# EasyEDA Pro project ProPrj_Hitboard PCB v2.epro

# Board PCB1
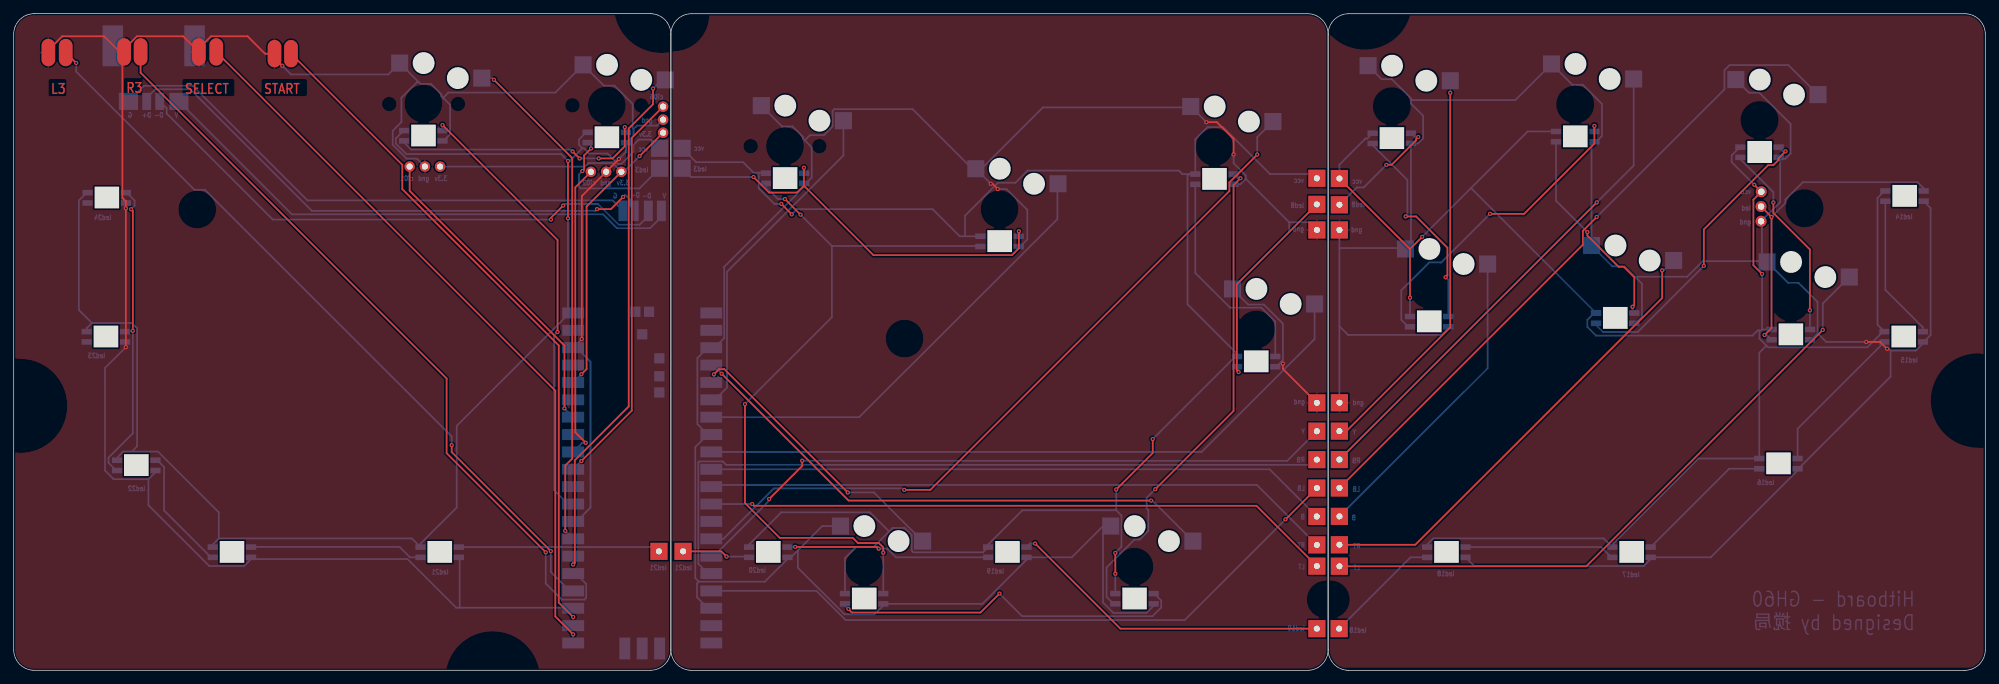
[diagram p0: board, top side]
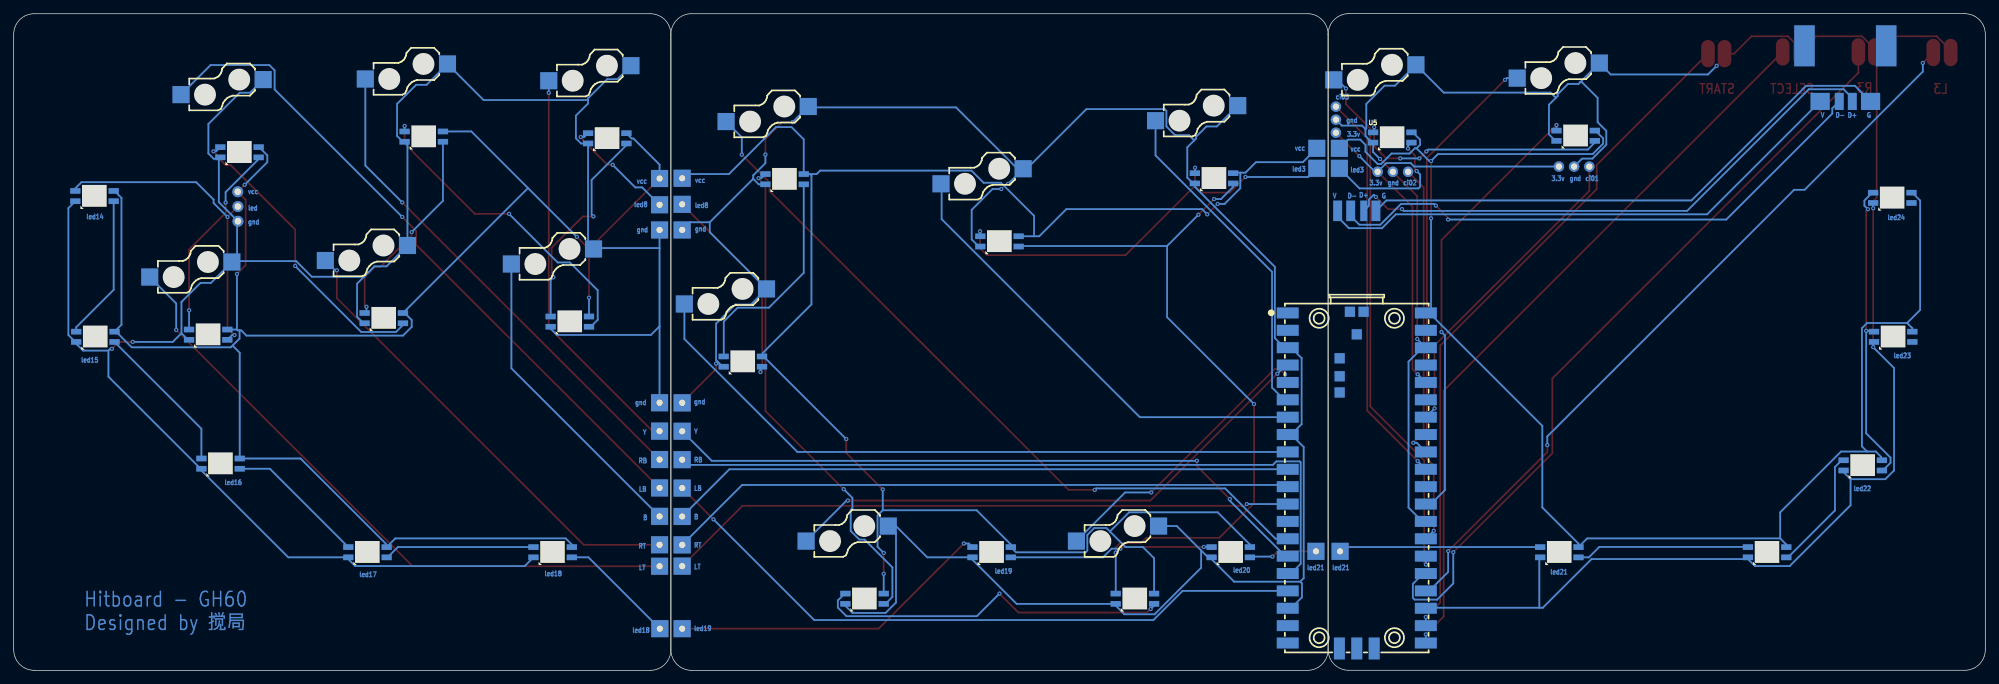
[diagram p1: board, bottom side, seen from below]

Outline 288.03 x 96.01 mm; copper layers: Top Layer, Bottom Layer. Coordinates in mm from the lower left corner of the outline.
Outline path: 0,93.01 0,3.01 arc(0.88,0.88) 3,0.01 93,0.01 arc(95.12,0.88) 96,3.01 96,93.01 arc(95.12,95.13) 93,96.01 3,96.01 arc(0.88,95.13) 0,93.01 ; 96.02,93 96.02,3 arc(96.9,0.88) 99.02,0 189.02,0 arc(191.14,0.88) 192.02,3 192.02,93 arc(191.14,95.12) 189.02,96 99.02,96 arc(96.9,95.12) 96.02,93 ; 192.03,93 arc(192.91,95.12) 195.03,96 285.03,96 arc(287.15,95.12) 288.03,93 288.03,3 arc(287.15,0.88) 285.03,0 195.03,0 arc(192.91,0.88) 192.03,3 192.03,93
Stack: Top Layer 0.035mm / Dielectric1 1.51mm FR4 er 4.5 / Bottom Layer 0.035mm

## Design rules (mm)
template: JLCPCB Capability(Two Layers Board)
spacing copperThickness1oz (default): track to track 0.102, other pairs 0.152 to 0.3
spacing copperThickness2oz: track to track 0.203, other pairs 0.152 to 0.3
track width copperThickness1oz (default): min 0.127, default 0.254, max 2.54
track width copperThickness2oz: min 0.203, default 0.254, max 2.54
differential pair differentialPair (default): width min 0.127, default 0.254, max 2.54; gap min 0.152, default 0.152
via viaSize (default): diameter min 0.5, default 0.61, max 10; hole min 0.3, default 0.305, max 6.3

## Placement (name value [footprint] x y rotation side)
NOREF  -  [Pad_e13637]  193.68 71.91 0 top
NOREF#2  -  [Pad_e53994]  26.42 91.31 180 top
NOREF#3  -  [Pad_e61147]  255.27 67.81 0 top
NOREF#4  -  [Pad_e61146]  255.3 69.97 0 top
NOREF#5  -  [Pad_e296]  60.07 73.65 0 top
NOREF#6  -  [Pad_e13608]  190.37 15.23 0 top
NOREF#7  -  [Pad_e48]  84.33 72.89 0 top
NOREF#8  -  [Pad_e46]  88.77 72.89 0 top
NOREF#9  -  [Pad_e686]  24.13 83.18 180 top
NOREF#10  -  [Pad_e4879]  94.26 17.39 0 top
NOREF#11  -  [Pad_e676]  7.6 90.33 0 top
NOREF#12  -  [Pad_e682]  40.51 90.16 0 top
NOREF#13  -  [Pad_e68]  193.68 39.13 0 top
NOREF#14  -  [Pad_e114539]  190.37 39.11 0 top
NOREF#15  -  [Pad_e4877]  190.37 6.09 0 top
NOREF#16  -  [Pad_e683]  16.76 83.18 180 top
NOREF#17  -  [Pad_e61148]  255.27 65.65 0 top
NOREF#18  -  [Pad_e4875]  193.64 6.09 0 top
NOREF#19  -  [Pad_e300]  94.87 80.51 0 top
NOREF#20  -  [Pad_e693]  92.71 67.18 180 top
NOREF#21  -  [Pad_e13606]  190.37 22.49 0 top
NOREF#22  -  [Pad_e13607]  190.37 18.34 0 top
NOREF#23  -  [Pad_e72]  193.68 22.51 0 top
NOREF#24  -  [Pad_e74]  193.68 15.22 0 top
NOREF#25  -  [Pad_e679]  27.05 90.42 0 top
NOREF#26  -  [Pad_e13601]  190.37 68.13 0 top
NOREF#27  -  [Pad_e687]  97.66 76.32 0 top
NOREF#28  -  [Pad_e295]  62.29 73.65 0 top
NOREF#29  -  [Pad_e53995]  14.48 91.31 180 top
NOREF#30  -  [Pad_e678]  18.54 90.42 0 top
NOREF#31  -  [Pad_e681]  38.1 90.16 0 top
NOREF#32  -  [Pad_e685]  21.34 83.18 180 top
NOREF#33  -  [Pad_e299]  94.87 78.61 0 top
NOREF#34  -  [Pad_e677]  16.13 90.42 0 top
NOREF#35  -  [Pad_e73]  193.68 18.36 0 top
NOREF#36  -  [Pad_e13602]  190.37 64.38 0 top
NOREF#37  -  [Pad_e13600]  190.37 71.94 0 top
NOREF#38  -  [Pad_e680]  29.59 90.42 0 top
NOREF#39  -  [Pad_e294]  86.55 72.89 0 top
NOREF#40  -  [Pad_e13603]  190.37 34.96 0 top
NOREF#41  -  [Pad_e4881]  97.79 17.39 0 top
NOREF#42  -  [Pad_e691]  90.81 67.18 180 top
NOREF#43  -  [Pad_e6736]  94.36 76.32 0 top
NOREF#44  -  [Pad_e675]  5.06 90.33 0 top
NOREF#45  -  [Pad_e71]  193.68 26.66 0 top
NOREF#46  -  [Pad_e684]  19.43 83.18 180 top
NOREF#47  -  [Pad_e6738]  94.36 73.4 0 top
NOREF#48  -  [Pad_e70]  193.68 30.82 0 top
NOREF#49  -  [Pad_e6737]  97.66 73.4 0 top
NOREF#50  -  [Pad_e13636]  193.68 64.38 0 top
NOREF#51  -  [Pad_e13635]  193.68 68.07 0 top
NOREF#52  -  [Pad_e69]  193.68 34.97 0 top
NOREF#53  -  [Pad_e13604]  190.37 30.8 0 top
NOREF#54  -  [Pad_e301]  94.87 82.42 0 top
NOREF#55  -  [Pad_e689]  89.03 67.18 180 top
NOREF#56  -  [Pad_e694]  94.61 67.18 180 top
NOREF#57  -  [Pad_e13605]  190.37 26.65 0 top
NOREF#58  -  [Pad_e297]  57.85 73.65 0 top
U1  PICO  [COMM-SMD_L51.0-W21.0-P2.54_SC0916]  91.82 27.81 270 bottom
U5  -  [LED-SMD_L3.2-W2.8_YO-WS2812B-3528]  59.84 78.16 180 bottom
U5#2  -  [LED-SMD_L3.2-W2.8_YO-WS2812B-3528]  144.02 62.71 180 bottom
U5#3  -  [LED-SMD_L3.2-W2.8_YO-WS2812B-3528]  276.23 69.34 180 bottom
U5#4  -  [LED-SMD_L3.2-W2.8_YO-WS2812B-3528]  276.1 48.76 180 bottom
U5#5  -  [LED-SMD_L3.2-W2.8_YO-WS2812B-3528]  257.81 30.22 180 bottom
U5#6  -  [LED-SMD_L3.2-W2.8_YO-WS2812B-3528]  209.3 17.27 180 bottom
U5#7  -  [LED-SMD_L3.2-W2.8_YO-WS2812B-3528]  145.16 17.27 180 bottom
U5#8  -  [LED-SMD_L3.2-W2.8_YO-WS2812B-3528]  110.24 17.27 180 bottom
U5#9  -  [LED-SMD_L3.2-W2.8_YO-WS2812B-3528]  62.23 17.27 180 bottom
U5#10  -  [LED-SMD_L3.2-W2.8_YO-WS2812B-3528]  31.88 17.27 180 bottom
U5#11  -  [LED-SMD_L3.2-W2.8_YO-WS2812B-3528]  13.46 48.76 180 bottom
U5#12  -  [LED-SMD_L3.2-W2.8_YO-WS2812B-3528]  13.59 69.08 180 bottom
U5#13  -  [LED-SMD_L3.2-W2.8_YO-WS2812B-3528]  17.91 29.97 180 bottom
U5#14  -  [LED-SMD_L3.2-W2.8_YO-WS2812B-3528]  236.35 17.27 180 bottom
U5#15  -  [LED-SMD_L3.2-W2.8_YO-WS2812B-3528]  86.64 77.91 180 bottom
U5#16  -  [LED-SMD_L3.2-W2.8_YO-WS2812B-3528]  112.68 71.94 180 bottom
U5#17  -  [LED-SMD_L3.2-W2.8_YO-WS2812B-3528]  124.23 10.47 180 bottom
U5#18  -  [LED-SMD_L3.2-W2.8_YO-WS2812B-3528]  163.73 10.47 180 bottom
U5#19  -  [LED-SMD_L3.2-W2.8_YO-WS2812B-3528]  175.41 71.81 180 bottom
U5#20  -  [LED-SMD_L3.2-W2.8_YO-WS2812B-3528]  181.51 45.14 180 bottom
U5#21  -  [LED-SMD_L3.2-W2.8_YO-WS2812B-3528]  201.32 77.78 180 bottom
U5#22  -  [LED-SMD_L3.2-W2.8_YO-WS2812B-3528]  206.78 50.98 180 bottom
U5#23  -  [LED-SMD_L3.2-W2.8_YO-WS2812B-3528]  228.12 78.03 180 bottom
U5#24  -  [LED-SMD_L3.2-W2.8_YO-WS2812B-3528]  233.96 51.49 180 bottom
U5#25  -  [LED-SMD_L3.2-W2.8_YO-WS2812B-3528]  255.04 75.75 180 bottom
U5#26  -  [LED-SMD_L3.2-W2.8_YO-WS2812B-3528]  259.62 49.08 180 bottom
U6  -  [CONN-SMD_HOTPLUGPAKAGE__C9900010116-1]  146.56 72.24 180 bottom
U6#2  -  [CONN-SMD_HOTPLUGPAKAGE__C9900010116-1]  62.38 87.68 180 bottom
U6#3  -  [CONN-SMD_HOTPLUGPAKAGE__C9900010116-1]  89.18 87.43 180 bottom
U6#4  -  [CONN-SMD_HOTPLUGPAKAGE__C9900010116-1]  115.22 81.46 180 bottom
U6#5  -  [CONN-SMD_HOTPLUGPAKAGE__C9900010116-1]  126.77 19.99 180 bottom
U6#6  -  [CONN-SMD_HOTPLUGPAKAGE__C9900010116-1]  166.27 19.99 180 bottom
U6#7  -  [CONN-SMD_HOTPLUGPAKAGE__C9900010116-1]  177.95 81.33 180 bottom
U6#8  -  [CONN-SMD_HOTPLUGPAKAGE__C9900010116-1]  184.05 54.66 180 bottom
U6#9  -  [CONN-SMD_HOTPLUGPAKAGE__C9900010116-1]  203.86 87.3 180 bottom
U6#10  -  [CONN-SMD_HOTPLUGPAKAGE__C9900010116-1]  209.32 60.51 180 bottom
U6#11  -  [CONN-SMD_HOTPLUGPAKAGE__C9900010116-1]  230.66 87.56 180 bottom
U6#12  -  [CONN-SMD_HOTPLUGPAKAGE__C9900010116-1]  236.5 61.01 180 bottom
U6#13  -  [CONN-SMD_HOTPLUGPAKAGE__C9900010116-1]  257.58 85.27 180 bottom
U6#14  -  [CONN-SMD_HOTPLUGPAKAGE__C9900010116-1]  262.16 58.6 180 bottom

## Footprints (pads in the part's own frame, mm; a bottom-side part is the same pattern mirrored in y, then rotated)
COMM-SMD_L51.0-W21.0-P2.54_SC0916
  rect 1.6x3.2 smd: 1(-24.445,-10.088) 2(-21.905,-10.088) 3(-19.365,-10.088) 4(-16.825,-10.088) 5(-14.285,-10.088) 6(-11.745,-10.088) 7(-9.205,-10.088) 8(-6.665,-10.088) 9(-4.125,-10.088) 10(-1.585,-10.088) 11(0.955,-10.088) 12(3.495,-10.088) 13(6.035,-10.088) 14(8.575,-10.088) 15(11.115,-10.088) 16(13.655,-10.088) 17(16.195,-10.088) 18(18.735,-10.088) 19(21.275,-10.088) 20(23.815,-10.088) 21(23.815,10.088) 22(21.275,10.088) 23(18.735,10.088) 24(16.195,10.088) 25(13.655,10.088) 26(11.115,10.088) 27(8.575,10.088) 28(6.035,10.088) 29(3.495,10.088) 30(0.955,10.088) 31(-1.585,10.088) 32(-4.125,10.088) 33(-6.665,10.088) 34(-9.205,10.088) 35(-11.745,10.088) 36(-14.285,10.088) 37(-16.825,10.088) 38(-19.365,10.088) 39(-21.905,10.088) 40(-24.445,10.088)
  rect 3.2x1.6 smd: 41(24.615,-2.54) 42(24.615,0) 43(24.615,2.54)
  rect 1.5x1.5 smd: TP1(-21.315,0) TP2(-24.615,1) TP3(-24.615,-1) TP4(-17.815,-2.5) TP5(-15.188,-2.5) TP6(-12.815,-2.5)
CONN-SMD_HOTPLUGPAKAGE__C9900010116-1
  rect 2.5x2.5 smd: 1(-6,-1.1) 2(6,1.1)
LED-SMD_L3.2-W2.8_YO-WS2812B-3528
  rect 1.5x0.82 smd: 1(2.8,0.75) 2(2.8,-0.75) 3(-2.8,-0.75) 4(-2.8,0.75)
Pad_e46
  round 1.524 hole 0.914: 1(0,0)
Pad_e48
  round 1.524 hole 0.914: 1(0,0)
Pad_e68
  rect 2.5x2.5 hole 0.9: PTH(0,0)
Pad_e69
  rect 2.5x2.5 hole 0.9: PTH(0,0)
Pad_e70
  rect 2.5x2.5 hole 0.9: PTH(0,0)
Pad_e71
  rect 2.5x2.5 hole 0.9: PTH(0,0)
Pad_e72
  rect 2.5x2.5 hole 0.9: PTH(0,0)
Pad_e73
  rect 2.5x2.5 hole 0.9: PTH(0,0)
Pad_e74
  rect 2.5x2.5 hole 0.9: PTH(0,0)
Pad_e294
  round 1.524 hole 0.914: 1(0,0)
Pad_e295
  round 1.524 hole 0.914: 1(0,0)
Pad_e296
  round 1.524 hole 0.914: 1(0,0)
Pad_e297
  round 1.524 hole 0.914: 1(0,0)
Pad_e299
  round 1.524 hole 0.914: 1(0,0)
Pad_e300
  round 1.524 hole 0.914: 1(0,0)
Pad_e301
  round 1.524 hole 0.914: 1(0,0)
Pad_e675
  oval 2x4 smd: 1(0,0)
Pad_e676
  oval 2x4 smd: 1(0,0)
Pad_e677
  oval 2x4 smd: 1(0,0)
Pad_e678
  oval 2x4 smd: 1(0,0)
Pad_e679
  oval 2x4 smd: 1(0,0)
Pad_e680
  oval 2x4 smd: 1(0,0)
Pad_e681
  oval 2x4 smd: 1(0,0)
Pad_e682
  oval 2x4 smd: 1(0,0)
Pad_e683
  rect 2.8x2.5 smd far side: PTH(0,0)
Pad_e684
  rect 1.3x2.5 smd far side: PTH(0,0)
Pad_e685
  rect 1.3x2.5 smd far side: PTH(0,0)
Pad_e686
  rect 2.8x2.5 smd far side: PTH(0,0)
Pad_e687
  rect 2.5x2.5 smd far side: PTH(0,0)
Pad_e689
  rect 1.3x3 smd far side: PTH(0,0)
Pad_e691
  rect 1x3 smd far side: PTH(0,0)
Pad_e693
  rect 1.3x3 smd far side: PTH(0,0)
Pad_e694
  rect 1.3x3 smd far side: PTH(0,0)
Pad_e4875
  rect 2.5x2.5 hole 0.9: PTH(0,0)
Pad_e4877
  rect 2.5x2.5 hole 0.9: PTH(0,0)
Pad_e4879
  rect 2.5x2.5 hole 0.9: PTH(0,0)
Pad_e4881
  rect 2.5x2.5 hole 0.9: PTH(0,0)
Pad_e6736
  rect 2.5x2.5 smd far side: PTH(0,0)
Pad_e6737
  rect 2.5x2.5 smd far side: PTH(0,0)
Pad_e6738
  rect 2.5x2.5 smd far side: PTH(0,0)
Pad_e13600
  rect 2.5x2.5 hole 0.9: PTH(0,0)
Pad_e13601
  rect 2.5x2.5 hole 0.9: PTH(0,0)
Pad_e13602
  rect 2.5x2.5 hole 0.9: PTH(0,0)
Pad_e13603
  rect 2.5x2.5 hole 0.9: PTH(0,0)
Pad_e13604
  rect 2.5x2.5 hole 0.9: PTH(0,0)
Pad_e13605
  rect 2.5x2.5 hole 0.9: PTH(0,0)
Pad_e13606
  rect 2.5x2.5 hole 0.9: PTH(0,0)
Pad_e13607
  rect 2.5x2.5 hole 0.9: PTH(0,0)
Pad_e13608
  rect 2.5x2.5 hole 0.9: PTH(0,0)
Pad_e13635
  rect 2.5x2.5 hole 0.9: PTH(0,0)
Pad_e13636
  rect 2.5x2.5 hole 0.9: PTH(0,0)
Pad_e13637
  rect 2.5x2.5 hole 0.9: PTH(0,0)
Pad_e53994
  rect 3x6 smd far side: PTH(0,0)
Pad_e53995
  rect 3x6 smd far side: PTH(0,0)
Pad_e61146
  round 1.6 hole 0.96: PTH(0,0)
Pad_e61147
  round 1.6 hole 0.96: PTH(0,0)
Pad_e61148
  round 1.6 hole 0.96: PTH(0,0)
Pad_e114539
  rect 2.5x2.5 hole 0.9: PTH(0,0)

## Nets
3V3: NOREF#8.1 NOREF#28.1 NOREF#33.1 U1.36
GND: NOREF#5.1 NOREF#13.PTH NOREF#14.PTH NOREF#17.PTH NOREF#19.1 NOREF#25.1 NOREF#31.1 NOREF#34.1 NOREF#36.PTH NOREF#39.1 NOREF#44.1 NOREF#50.PTH U1.3 U1.8 U1.18 U1.23 U1.28 U1.38 U5.3 U5#2.3 U5#3.3 U5#4.3 U5#5.3 U5#6.3 U5#7.3 U5#8.3 U5#9.3 U5#10.3 U5#11.3 U5#12.3 U5#13.3 U5#14.3 U5#15.3 U5#16.3 U5#17.3 U5#18.3 U5#19.3 U5#20.3 U5#21.3 U5#22.3 U5#23.3 U5#24.3 U5#25.3 U5#26.3 U6.2 U6#2.2 U6#3.2 U6#4.2 U6#5.2 U6#6.2 U6#7.2 U6#8.2 U6#9.2 U6#10.2 U6#11.2 U6#12.2 U6#13.2 U6#14.2
VCC: NOREF.PTH NOREF#4.PTH NOREF#27.PTH NOREF#37.PTH NOREF#43.PTH U1.40 U5.1 U5#2.1 U5#3.1 U5#4.1 U5#5.1 U5#6.1 U5#7.1 U5#8.1 U5#9.1 U5#10.1 U5#11.1 U5#12.1 U5#13.1 U5#14.1 U5#15.1 U5#16.1 U5#17.1 U5#18.1 U5#19.1 U5#20.1 U5#21.1 U5#22.1 U5#23.1 U5#24.1 U5#25.1 U5#26.1
2: U5.2 U5#15.4
3: NOREF#47.PTH NOREF#49.PTH U5#2.4 U5#15.2 U5#16.4
4: U5#2.2 U5#16.2 U5#17.4
5: U5#17.2 U5#18.4
6: U5#18.2 U5#19.4
7: U5#19.2 U5#20.4
8: NOREF#26.PTH NOREF#51.PTH U5#20.2 U5#21.4
9: U5#21.2 U5#22.4
10: U5#22.2 U5#23.4
11: U5#23.2 U5#24.4
12: U5#24.2 U5#25.4
13: U5#25.2 U5#26.4
14: NOREF#3.PTH U5#3.4 U5#26.2
15: U5#3.2 U5#4.4
16: U5#4.2 U5#5.4
17: U5#5.2 U5#14.4
18: U5#6.4 U5#14.2
19: NOREF#15.PTH NOREF#18.PTH U5#6.2 U5#7.4
20: U5#7.2 U5#8.4
21: NOREF#10.PTH NOREF#41.PTH U5#8.2 U5#9.4
22: U5#9.2 U5#10.4
23: U5#10.2 U5#13.4
24: U5#11.4 U5#12.4 U5#13.2
25: U5#11.2
26: U5#12.2
A: U1.9 U6#8.1
B: NOREF#21.PTH NOREF#23.PTH U1.10 U6#10.1
BUTTON1: U1.5 U6#5.1
BUTTON2: U1.7 U6.1
D+: NOREF#42.PTH NOREF#46.PTH
D-: NOREF#20.PTH NOREF#32.PTH
DOWN: U1.26 U6#3.1
G: NOREF#16.PTH NOREF#55.PTH
L3: NOREF#11.1 U1.24
LB: NOREF#45.PTH NOREF#57.PTH U1.17 U6#13.1
LED1: U1.29 U5.4
LEFT: U1.27 U6#2.1
LINEBUTTON01: NOREF#58.1 U1.34
LINEBUTTON02: NOREF#7.1 U1.32
LINEBUTTON03: NOREF#54.1 U1.31
LT: NOREF#6.PTH NOREF#24.PTH U1.12 U6#14.1
R3: NOREF#30.1 U1.25
RB: NOREF#48.PTH NOREF#53.PTH U1.16 U6#11.1
RIGHT: U1.6 U6#4.1
RT: NOREF#22.PTH NOREF#35.PTH U1.11 U6#12.1
SELECT: NOREF#38.1 U1.21
START: NOREF#12.1 U1.22
UP: U1.4 U6#6.1
V: NOREF#9.PTH NOREF#56.PTH
X: U1.14 U6#7.1
Y: NOREF#40.PTH NOREF#52.PTH U1.15 U6#9.1

Pads without a net: NOREF#2 PTH; NOREF#29 PTH; U1 1 2 13 19 20 30 33 35 37 39 41 42 43 TP1 TP2 TP3 TP4 TP5 TP6

## Via types
v1: diameter 0.61, hole 0.305, Top Layer to Bottom Layer, 98 vias

## Routing (per net, layer and track width the routed paths; a pad name or vN(x,y) marks a point on that pad's centre or on a via; arc(x,y) is an arc through that point)
3V3: length 69.4
  Top Layer w0.254: v1(82.93,43.29) 83.69,44.05 83.69,67.81 NOREF#8.1 ; v1(91.44,75.18) NOREF#33.1
  Bottom Layer w0.254: v1(82.93,43.29) U1.36 ; NOREF#28.1 83.44,73.65 83.95,74.16 87.5,74.16 NOREF#8.1 89.15,72.89 v1(91.44,75.18)
GND: length 1032.7
  Top Layer w0.254: v1(174.24,80.15) 175.76,80.15 178.21,77.7 v1(178.21,75.41) ; 37.97,90.16 37.97,89.66 v1(39.24,88.39) ; 37.97,90.16 36.7,90.16 34.16,92.7 28.83,92.7 27.05,90.93 NOREF#25.1 24.77,92.7 18.02,92.7 15.98,90.67 15.98,90.42 ; 37.97,90.16 NOREF#31.1 ; NOREF#14.PTH 185.42,44.07 v1(185.42,44.84) ; NOREF#44.1 5.06,90.67 7.09,92.7 13.19,92.7 15.48,90.42 15.98,90.42 ; v1(82.99,48.43) 82.99,69.34 NOREF#39.1 v1(88.43,74.77) ; v1(143.76,70.37) 143,71.13 v1(142.74,71.13) ; v1(270.63,48.02) 272.67,48.02 v1(273.68,47) ; v1(16.38,47.25) v1(16.38,67.56) 16.38,68.57 15.88,69.08 15.88,90.16 NOREF#34.1 15.98,90.42
  Bottom Layer w0.254: U1.18 101.43,9.07 99.83,10.67 99.83,12.71 100.08,12.96 ; U6#4.2 112.26,79.51 113.79,79.51 115.31,77.99 115.31,77.73 115.57,77.48 ; 141.22,72.66 v1(142.74,71.13) ; 141.22,72.66 140.46,73.42 ; 141.22,72.66 141.22,73.16 150.36,82.31 171.83,82.31 U6#7.2 v1(174.24,80.15) ; 62.73,83.7 63.5,84.47 79.12,84.47 U6#3.2 86.23,85.48 87.75,85.48 90.43,82.81 90.43,79.25 90.55,79.13 ; 62.73,83.7 63.75,82.69 63.75,78.37 62.79,77.41 U5.3 ; 62.73,83.7 62.48,83.96 62.48,84.21 60.96,85.74 59.43,85.74 59.18,85.99 ; 114.56,17.53 114.56,14.99 121.36,8.19 125.76,8.19 126.95,9.38 126.95,9.63 U5#17.3 141.51,9.72 147.96,16.17 U5#7.3 154.56,16.52 159.14,21.09 160.15,21.09 ; 114.56,17.53 113.54,16.52 U5#8.3 113.04,16.26 109.73,12.96 100.08,12.96 ; 114.56,17.53 118.12,21.09 U6#5.2 ; 203.2,61.73 U6#10.2 ; 203.2,61.73 193.68,61.73 ; 203.2,61.73 204.12,62.66 U5#21.3 205.14,77.03 205.9,77.79 205.9,81.09 204.12,82.87 204.12,83.38 ; v1(143.76,70.37) 145.03,70.37 148.08,67.32 148.08,63 147.18,62.11 146.96,62.11 U5#2.3 ; 100.08,12.96 99.57,13.47 99.57,32.65 101.4,34.47 ; 193.68,61.73 NOREF#50.PTH ; 193.68,61.73 193.68,50.3 ; v1(82.99,48.43) 81.98,47.42 ; 81.98,47.42 U1.38 ; 81.98,47.42 84.26,45.13 84.26,23.8 82.24,21.77 U1.28 ; 59.18,85.99 58.92,85.99 56.64,83.7 56.64,80.15 55.37,78.88 55.37,76.85 57.4,74.81 58.91,74.81 NOREF#5.1 ; 59.18,85.99 U6#2.2 54.72,87.12 40.51,87.12 v1(39.24,88.39) ; 204.12,83.38 219.38,83.38 U6#11.2 227.71,85.61 229.23,85.61 232.03,82.81 232.03,78.13 231.17,77.28 U5#23.3 230.5,76.86 U6#12.2 233.55,59.07 235.33,59.07 236.85,57.54 ; 204.12,83.38 204.12,83.63 201.33,86.43 199.84,86.43 U6#9.2 ; 140.46,73.42 U6.2 ; 140.46,73.42 139.95,73.42 131.31,82.05 119.88,82.05 119.63,81.8 119.63,79.51 118.36,78.24 116.33,78.24 115.57,77.48 ; v1(273.68,47) 273.94,47 274.19,46.75 ; 236.85,57.54 244.47,57.54 246.76,59.83 255.39,59.83 ; 236.85,57.54 237.87,56.53 237.87,51.7 236.91,50.74 U5#24.3 ; 160.15,21.09 159.14,20.07 159.14,9.91 160.66,8.39 165.49,8.39 166.53,9.43 U5#18.3 ; 160.15,21.09 U6#6.2 ; U5#20.3 184.46,44.39 185.16,45.1 ; 90.55,79.13 91.06,79.64 94,79.64 NOREF#19.1 ; 90.55,79.13 90.55,78.12 89.59,77.16 U5#15.3 89.44,75.78 v1(88.43,74.77) ; 65.15,9.15 64.64,9.15 57.53,16.26 34.67,16.26 ; 65.15,9.15 81.66,9.15 U1.23 ; 65.15,9.15 65.15,16.4 U5#9.3 ; 179.99,71.86 179.99,72.36 178.21,74.14 v1(178.21,75.41) ; 179.99,71.86 186.34,65.51 ; 179.99,71.86 179.2,71.06 U5#19.3 ; 19.68,27.95 14.61,27.95 13.34,29.22 13.34,44.2 v1(16.38,47.25) 16.38,47.89 U5#11.3 ; 19.68,27.95 19.68,24.14 28.57,15.25 33.66,15.25 34.67,16.26 ; 19.68,27.95 20.71,28.97 U5#13.3 ; 115.57,77.48 116.58,76.47 116.58,72.04 115.73,71.19 U5#16.3 115.48,70.68 103.79,58.99 103.79,48.58 102.39,47.17 U1.3 101.4,47.17 99.88,45.65 99.88,36 101.4,34.47 ; 34.67,16.26 U5#10.3 ; 193.68,50.3 194.94,49.03 208.66,49.03 209.58,49.95 U5#22.3 ; 193.68,50.3 NOREF#13.PTH ; 274.19,46.75 274.19,42.94 260.85,29.59 260.73,29.59 U5#5.3 260.61,29.22 247.91,16.52 U5#14.3 239.15,16.26 238.13,15.25 213.37,15.25 U5#6.3 ; 274.19,46.75 277.89,46.75 278.79,47.64 278.79,47.9 U5#4.3 279.02,48.01 280.04,49.03 280.04,67.57 279.02,68.59 ; U6#13.2 253.51,84.45 255.02,84.45 259.59,79.88 259.59,75.56 258.83,74.8 258.06,74.8 ; 258.06,74.8 U5#25.3 ; 258.06,74.8 258.06,68.45 NOREF#17.PTH 255.39,65.53 255.39,59.83 ; 101.4,34.47 U1.8 ; 263.52,49.29 263.52,53.86 260.73,56.65 259.2,56.65 U6#14.2 256.03,59.83 255.39,59.83 ; 263.52,49.29 264.79,48.02 v1(270.63,48.02) ; 263.52,49.29 262.56,48.33 U5#26.3 ; NOREF#36.PTH 189.25,65.51 186.34,65.51 ; 185.16,45.1 v1(185.42,44.84) ; 185.16,45.1 185.42,45.35 185.42,50.68 182.62,53.48 180.34,53.48 U6#8.2 186.34,64.06 186.34,65.51 ; v1(16.38,67.56) 16.38,68.33
VCC: length 747.6
  Top Layer w0.254: v1(254.28,70.99) NOREF#4.PTH 254.15,68.82 254.15,59.22 v1(255.42,57.95) ; 203.98,61.6 v1(205.76,63.38) ; 203.98,61.6 v1(203.98,54.49) ; 203.98,61.6 NOREF.PTH ; v1(160.93,17.16) v1(160.93,14.12) ; v1(166.4,33.81) 166.4,31.78 v1(161.07,26.45) ; v1(112.14,68.19) v1(113.67,66.67) ; v1(80.97,74.47) v1(80.97,66.08)
  Bottom Layer w0.254: U5#11.1 10.66,50.02 11.42,50.78 ; v1(203.98,54.49) U5#22.1 ; 212.87,70.49 212.91,70.49 U5#24.1 230.91,52.24 229.89,51.22 229.89,50.21 231.16,48.94 254.02,48.94 254.78,49.7 255.04,49.7 ; 212.87,70.49 v1(205.76,63.38) ; 212.87,70.49 221.17,78.78 U5#23.1 ; 178.59,46 U5#20.1 ; 178.59,46 178.59,46.4 171.48,53.51 171.48,72.31 171.74,72.56 ; 178.59,46 v1(166.4,33.81) ; 127.88,20.3 125.09,23.1 112.14,23.1 107.44,18.4 U5#8.1 ; 127.88,20.3 128.39,20.81 130.17,20.81 131.19,19.79 131.19,17.51 131.44,17.25 141.6,17.25 U5#7.1 142.36,18.41 147.35,23.4 161.07,23.4 ; 127.88,20.3 125.6,18.02 123.06,18.02 121.43,16.39 U5#17.1 ; 29.97,19.29 29.08,18.4 U5#10.1 ; 29.97,19.29 58.16,19.29 U5#9.1 59.43,18.52 64.72,23.8 64.72,35.74 81.23,52.25 U1.40 80.97,53.01 v1(80.97,66.08) ; 29.97,19.29 29.97,23.1 21.08,31.99 17.27,31.99 ; 138.97,63.46 U5#2.1 ; 138.97,63.46 138.21,63.46 134.24,67.43 114.43,67.43 v1(113.67,66.67) ; 138.97,63.46 138.97,66.46 143.8,71.29 146.34,71.29 148.12,73.07 170.21,73.07 170.72,72.56 171.74,72.56 ; U5#3.1 273.3,70.09 272.28,69.07 272.28,50.53 U5#4.1 273.07,49.51 270.79,47.23 256.31,47.23 256.05,47.48 ; 83.08,76.32 83.33,76.32 84.1,75.56 86.74,75.56 88.27,74.03 88.77,74.03 90.55,75.81 90.55,76.83 91.31,77.59 93.09,77.59 NOREF#43.PTH ; 83.08,76.32 82.57,76.83 82.57,77.59 83.64,78.66 U5#15.1 ; 83.08,76.32 81.23,74.47 v1(80.97,74.47) 79.96,75.48 57.35,75.48 55.83,77.01 55.83,77.77 56.97,78.91 U5.1 ; U5#6.1 206.5,18.4 207.38,19.29 232.28,19.29 U5#14.1 233.67,18.14 233.67,18.52 246.12,30.97 U5#5.1 255.01,46.44 256.05,47.48 ; 255.42,49.83 v1(255.42,57.95) ; 255.42,49.83 255.29,49.7 255.04,49.7 ; 255.42,49.83 U5#26.1 ; NOREF#27.PTH 99.69,74.29 106.55,74.29 108.08,72.77 108.84,72.77 ; NOREF#37.PTH 189.75,72.56 183.54,72.56 176.68,79.42 174.39,79.42 172.61,77.64 U5#19.1 171.74,72.56 ; v1(160.93,17.16) 161.83,18.06 161.83,22.64 161.07,23.4 ; U5#16.1 109.8,72.77 108.84,72.77 ; 161.07,23.4 v1(161.07,26.45) ; U5#13.1 15.23,30.84 15.23,31.22 16,31.99 17.27,31.99 ; U5#25.1 252.17,76.5 250.98,75.31 250.98,74.29 v1(254.28,70.99) ; 256.05,47.48 255.04,48.5 255.04,49.7 ; U5#21.1 197.74,77.75 197.49,77.75 193.68,73.94 NOREF.PTH ; 11.42,50.78 17.27,50.78 18.03,50.02 18.03,32.75 17.27,31.99 ; 11.42,50.78 9.52,52.69 9.52,68.69 10.66,69.83 10.79,69.83 ; 108.84,72.77 108.84,70.48 111.12,68.19 v1(112.14,68.19) ; v1(160.93,14.12) U5#18.1
2: length 37.8
  Top Layer w0.254: v1(81.66,75.86) v1(82.67,74.84) ; v1(85.47,74.84) 87.5,74.84 89.28,76.62 v1(89.28,79.42)
  Bottom Layer w0.254: v1(81.66,75.86) 81.38,76.14 58.06,76.14 57.04,77.16 U5.2 ; v1(82.67,74.84) v1(85.47,74.84) ; U5#15.4 89.28,78.82 v1(89.28,79.42)
3: length 82.9
  Top Layer w0.254: 115.44,70.86 114.43,69.84 110.36,69.84 v1(108.08,72.13) ; 115.44,70.86 125.6,60.7 145.84,60.7 146.85,61.72 v1(146.85,64.19) ; 115.44,70.86 v1(115.44,73.48) ; v1(83.08,73) 83.33,73.25 83.33,75.28 v1(84.35,76.3)
  Bottom Layer w0.254: NOREF#49.PTH 98.93,72.13 v1(108.08,72.13) ; v1(84.35,76.3) 84.35,76.65 U5#15.2 ; U5#16.4 115.44,72.72 v1(115.44,73.48) ; v1(146.85,64.19) 146.85,63.49 U5#2.4 ; NOREF#47.PTH 91.42,70.46 82.83,70.46 82.57,70.71 82.57,72.49 v1(83.08,73)
4: length 107.9
  Top Layer w0.254: v1(106.83,38.93) 106.83,24.45 111.91,19.37 122.58,19.37 123.34,18.61 126.39,18.61 127.03,17.96 v1(127.03,17.2) ; v1(112.67,68.9) v1(114.96,66.61)
  Bottom Layer w0.254: U5#2.2 141.14,62.04 119.53,62.04 ; U5#16.2 109.88,70.68 111.65,68.9 v1(112.67,68.9) ; 119.53,62.04 119.53,51.63 v1(106.83,38.93) ; 119.53,62.04 v1(114.96,66.61) ; v1(127.03,17.2) U5#17.4
5: length 52.5
  Top Layer w0.254: v1(144.02,11.22) 141.25,8.45 122.45,8.45 v1(121.94,8.96)
  Bottom Layer w0.254: U5#18.4 166.62,11.22 167.64,10.2 167.64,9.19 166.37,7.92 147.32,7.92 v1(144.02,11.22) ; v1(121.94,8.96) 121.43,9.46 U5#17.2
6: length 72.9
  Top Layer w0.254: v1(166.77,26.48) 178.2,37.91 178.2,70.93 v1(179.22,71.95)
  Bottom Layer w0.254: U5#18.2 160.68,9.72 159.66,10.73 159.66,15.05 163.72,19.12 164.49,19.12 165.76,20.39 165.76,23.43 165.5,23.69 165.5,25.21 v1(166.77,26.48) ; v1(179.22,71.95) 178.83,71.95 U5#19.4
7: length 32.7
  Bottom Layer w0.254: U5#20.4 184.3,45.9 184.3,50.99 182.27,53.03 177.69,53.03 172.61,58.11 U5#19.2
8: length 47.4
  Top Layer w0.254: NOREF#26.PTH 178.69,56.45 178.69,43.86 v1(178.94,43.61) ; v1(205.19,77.97) 204.87,77.65 204.87,77.48 201.29,73.91 v1(200.53,73.91)
  Bottom Layer w0.254: NOREF#51.PTH 196.22,70.61 197.23,70.61 v1(200.53,73.91) ; v1(205.19,77.97) 204.68,77.97 U5#21.4 ; U5#20.2 178.94,44.16 v1(178.94,43.61)
9: length 31.2
  Top Layer w0.254: v1(203.35,66.36) 204.87,66.36 209.44,61.79 209.44,57.72 v1(209.19,57.47)
  Bottom Layer w0.254: U5#21.2 198.52,76.77 203.6,71.69 203.6,66.61 v1(203.35,66.36) ; v1(209.19,57.47) 209.58,57.08 U5#22.4
10: length 46.5
  Top Layer w0.254: v1(230.92,79.59) 230.92,77 220.66,66.74 v1(215.67,66.74)
  Bottom Layer w0.254: v1(215.67,66.74) 208.56,59.63 206.78,59.63 202.71,55.56 202.71,51.25 203.73,50.23 U5#22.2 ; v1(230.92,79.59) U5#23.4
11: length 30.4
  Top Layer w0.254: v1(236.5,53.15) 236.75,53.41 236.75,57.47 235.23,58.99 234.46,58.99 229.89,63.57 v1(229.89,64.07)
  Bottom Layer w0.254: U5#23.2 225.32,68.65 v1(229.89,64.07) ; v1(236.5,53.15) 236.5,52.5 U5#24.4
12: length 43.8
  Top Layer w0.254: v1(246.91,59.12) 246.91,64.45 256.31,73.85 257.07,73.85 257.83,74.61 257.83,74.87 v1(258.85,75.89)
  Bottom Layer w0.254: U5#24.2 231.16,50.48 232.18,49.47 237.26,49.47 v1(246.91,59.12) ; v1(258.85,75.89) 258.45,75.89 U5#25.4
13: length 29.4
  Top Layer w0.254: v1(257.07,68.39) 257.07,66.87 262.4,61.53 v1(262.4,52.64)
  Bottom Layer w0.254: v1(262.4,52.64) 262.4,49.84 U5#26.4 ; v1(257.07,68.39) 257.07,69.92 252.24,74.74 U5#25.2
14: length 46.6
  Top Layer w0.254: v1(255.78,49.02) 256.79,50.03 v1(256.79,66.29) NOREF#3.PTH
  Bottom Layer w0.254: v1(256.79,66.29) 258.83,68.32 258.83,68.83 261.37,71.37 278.13,71.37 279.02,70.47 279.02,70.09 ; v1(255.78,49.02) 256.13,49.02 U5#26.2
15: length 21.3
  Bottom Layer w0.254: U5#4.4 278.9,50.16 273.43,55.63 U5#3.2
16: length 22.3
  Bottom Layer w0.254: U5#4.2 260.61,35.32 U5#5.4
17: length 20.6
  Bottom Layer w0.254: U5#14.4 250.6,29.47 U5#5.2
18: length 22.1
  Bottom Layer w0.254: U5#14.2 233.32,16.75 233.18,16.75 231.91,18.02 U5#6.4
19: length 65
  Top Layer w0.254: NOREF#15.PTH 161.67,6.09 v1(149.22,18.54)
  Bottom Layer w0.254: U5#7.4 148.48,18.54 v1(149.22,18.54) ; U5#6.2 204.06,16.52 NOREF#18.PTH
20: length 30
  Top Layer w0.254: v1(126.36,17.79) 126.11,18.04 v1(114.17,18.04)
  Bottom Layer w0.254: U5#8.4 113.06,18.04 v1(114.17,18.04) ; v1(126.36,17.79) 127.63,17.79 128.9,16.52 U5#7.2
21: length 39.5
  Top Layer w0.254: v1(104.14,16.63) 103.38,17.39 NOREF#41.PTH
  Bottom Layer w0.254: NOREF#10.PTH 93.64,18.02 U5#9.4 ; U5#8.2 107.32,16.63 v1(104.14,16.63)
22: length 25.4
  Bottom Layer w0.254: U5#10.4 34.7,18.04 56.38,18.04 57.91,16.52 U5#9.2
23: length 18
  Bottom Layer w0.254: U5#10.2 28.82,16.52 21.96,23.37 21.96,29.72 21.07,30.62 20.8,30.62 U5#13.4
24: length 44.9
  Top Layer w0.254: v1(17.41,49.64) 17.41,67.17 v1(17.15,67.42)
  Bottom Layer w0.254: U5#11.4 16.39,49.64 17.15,49.64 ; U5#12.4 16.52,69.83 17.66,68.69 17.66,67.93 v1(17.15,67.42) ; 17.15,49.64 17.41,49.39 17.41,34.65 13.85,31.1 13.85,30.33 14.97,29.22 U5#13.2 ; 17.15,49.64 v1(17.41,49.64)
A: length 100.1
  Bottom Layer w0.254: U1.9 173.54,31.93 190.05,48.44 190.05,53.56
B: length 137.2
  Bottom Layer w0.254: U1.10 183.47,29.39 NOREF#21.PTH ; U6#10.1 215.32,44.16 NOREF#23.PTH
BUTTON1: length 42.6
  Top Layer w0.254: v1(102.29,43.28) 103.06,44.04 103.82,44.04 v1(121.85,26)
  Bottom Layer w0.254: v1(121.85,26) 125.66,26 U6#5.1 ; v1(102.29,43.28) 102.29,42.48 U1.5
BUTTON2: length 67.8
  Bottom Layer w0.254: U1.7 123.51,37.01 152.47,65.97 152.47,71.05 U6.1
D+: length 82.2
  Top Layer w0.254: v1(85.22,67.43) 87.25,67.43 v1(89.03,69.21)
  Bottom Layer w0.254: NOREF#46.PTH 19.43,83.69 20.7,84.96 25.78,84.96 43.56,67.18 84.96,67.18 v1(85.22,67.43) ; v1(89.03,69.21) 89.34,69.53 90.04,68.83 90.04,67.94 NOREF#42.PTH
D-: length 82.6
  Top Layer w0.254: v1(78.49,65.91) 78.49,66.16 v1(80.26,67.94)
  Bottom Layer w0.254: NOREF#32.PTH 22.35,82.16 22.35,81.4 37.85,65.91 v1(78.49,65.91) ; NOREF#20.PTH 92.71,66.42 91.44,65.14 88.39,65.14 85.34,68.19 80.52,68.19 v1(80.26,67.94)
DOWN: length 78
  Top Layer w0.254: v1(93.4,85.06) 93.4,82.77 89.85,79.22 89.85,38.58 81.97,30.7 81.97,15.72 v1(81.72,15.46)
  Bottom Layer w0.254: v1(93.4,85.06) 94.67,86.33 U6#3.1 ; U1.26 81.72,16.68 v1(81.72,15.46)
G: length 80.8
  Bottom Layer w0.254: NOREF#55.PTH 87.5,68.7 42.93,68.7 26.16,85.47 19.05,85.47 NOREF#16.PTH
L3: length 110.6
  Top Layer w0.254: v1(63.99,32.92) 63.99,31.91 v1(78.47,17.43) ; NOREF#11.1 v1(9.13,88.8)
  Bottom Layer w0.254: U1.24 81.24,11.61 78.47,14.38 v1(78.47,17.43) ; v1(63.99,32.92) 63.99,34.19 27.92,70.26 26.4,70.26 9.13,87.53 v1(9.13,88.8)
LB: length 198.4
  Top Layer w0.254: NOREF#57.PTH v1(185.8,22.08) ; v1(231.27,66.29) 229.24,64.26 229.24,62.22 NOREF#45.PTH
  Bottom Layer w0.254: U1.17 117.27,11.61 121.54,7.34 171.07,7.34 v1(185.8,22.08) ; v1(231.27,66.29) 249.91,84.93 249.91,87.73 250.67,88.49 259.27,88.49 U6#13.1
LED1: length 65
  Top Layer w0.254: v1(79.45,49.46) 79.45,62.92 v1(62.64,79.72)
  Bottom Layer w0.254: U1.29 80.97,24.31 78.94,26.34 78.94,48.95 v1(79.45,49.46) ; v1(62.64,79.72) U5.4
LEFT: length 74.6
  Top Layer w0.254: v1(80.58,20.39) 80.58,29.94 81.59,30.96 81.59,74.9 v1(70.16,86.33)
  Bottom Layer w0.254: U6#2.1 69.91,86.58 v1(70.16,86.33) ; v1(80.58,20.39) U1.27
LINEBUTTON01: length 46.5
  Top Layer w0.254: v1(80.45,38.29) 80.45,47.49 57.85,70.1 NOREF#58.1
  Bottom Layer w0.254: v1(80.45,38.29) U1.34
LINEBUTTON02: length 43.6
  Top Layer w0.254: NOREF#7.1 82.04,70.61 82.04,34.79 v1(83.57,33.27)
  Bottom Layer w0.254: U1.32 83.07,33.27 v1(83.57,33.27)
LINEBUTTON03: length 58.5
  Top Layer w0.254: NOREF#54.1 90.3,77.84 90.3,37.97 v1(82.93,30.6)
  Bottom Layer w0.254: v1(82.93,30.6) 82.93,30.59 U1.31
LT: length 186.5
  Top Layer w0.254: NOREF#6.PTH 181.55,24.06 108.14,24.06 v1(107.89,24.31) ; NOREF#24.PTH 229.74,15.22 v1(264.29,49.76)
  Bottom Layer w0.254: v1(107.89,24.31) U1.12 ; U6#14.1 264.29,53.63 v1(264.29,49.76)
R3: length 113.8
  Top Layer w0.254: NOREF#30.1 18.54,87.37 63.25,42.67 63.25,31.74 v1(77.72,17.27)
  Bottom Layer w0.254: v1(77.72,17.27) 77.72,12.69 80.08,10.34 83.38,10.34 83.63,10.6 83.63,12.63 82.11,14.15 U1.25
RB: length 181.7
  Top Layer w0.254: NOREF#48.PTH v1(231.27,68.41)
  Bottom Layer w0.254: U6#11.1 236.66,73.8 v1(231.27,68.41) ; NOREF#53.PTH 189.61,30.04 104.08,30.04 103.57,30.55 100.16,30.55 100.02,30.4 100.02,15.56 101.29,14.29 101.77,14.29 U1.16
RIGHT: length 49.1
  Bottom Layer w0.254: 101.91,39.56 102.42,39.56 104.2,41.33 104.2,58.26 121.22,75.28 U6#4.1
RT: length 160.6
  Top Layer w0.254: v1(240.82,58.49) 240.82,54.42 204.75,18.36 NOREF#35.PTH
  Bottom Layer w0.254: v1(240.82,58.49) 241.08,58.49 U6#12.1 ; NOREF#22.PTH 181.61,27.11 102.16,27.11 U1.11
SELECT: length 108
  Top Layer w0.254: v1(81.73,5.26) 79.12,7.87 79.12,40.89 NOREF#38.1
  Bottom Layer w0.254: v1(81.73,5.26) U1.21
START: length 100.7
  Top Layer w0.254: v1(81.73,7.8) 79.63,9.9 79.63,47.49 56.77,70.35 56.77,73.91 NOREF#12.1
  Bottom Layer w0.254: v1(81.73,7.8) U1.22
UP: length 81
  Top Layer w0.254: v1(103.43,43.36) 121.97,24.82 v1(166.17,24.82)
  Bottom Layer w0.254: U6#6.1 166.34,24.82 v1(166.17,24.82) ; v1(103.43,43.36) 102.16,44.63 U1.4
V: length 79.7
  Bottom Layer w0.254: NOREF#56.PTH 94.61,66.29 92.96,64.64 88.14,64.64 86.11,66.67 40.64,66.67 NOREF#9.PTH
X: length 109.7
  Top Layer w0.254: v1(130.1,26.38) 133.91,26.38 177.6,70.07 177.6,71.34 v1(181.66,75.4)
  Bottom Layer w0.254: U1.14 103.69,19.23 111.05,26.6 129.89,26.6 v1(130.1,26.38) ; U6#7.1 181.66,77.94 v1(181.66,75.4)
Y: length 155.2
  Top Layer w0.254: NOREF#52.PTH 194.69,34.97 209.86,50.14 v1(209.86,84.43) ; v1(115.19,30.64) 115.19,29.88 v1(110.36,25.05)
  Bottom Layer w0.254: U1.15 102.14,16.92 102.49,16.92 110.36,24.8 v1(110.36,25.05) ; NOREF#40.PTH 186.06,30.64 v1(115.19,30.64) ; v1(209.86,84.43) U6#9.1

## Copper pours and planes (outline as drawn; the poured copper is in the pictures)
GND on Top Layer: 192.11,97.26 287.78,97.26 287.78,0.38 192.11,0.38
GND on Top Layer: 96.52,95.5 191.52,95.5 191.52,0.76 96.52,0.76
GND on Top Layer: 95.38,98.29 192.02,98.29 192.02,-1.91 95.38,-1.91
GND on Top Layer: -1.91,98.42 95.5,98.42 95.5,-1.78 -1.91,-1.78
GND on Top Layer: -3.81,101.09 97.92,101.09 97.92,-2.93 -3.81,-2.93

## Text on the board
Bottom Layer: led23 | led24 | G | led22 | D+ | D- | V | ci01 | gnd | 3.3v | led21 | ci02 | vcc | led3 | ci03 | led20 | led19 | led8 | Y | RB | LB | B | RT | LT | led18 | led17 | led | led16 | led14 | led15 | Hitboard - GH60 / Designed by 搅局
Top Layer: L3 | R3 | SELECT | START
